# Altium project RogoIR.PrjPcb
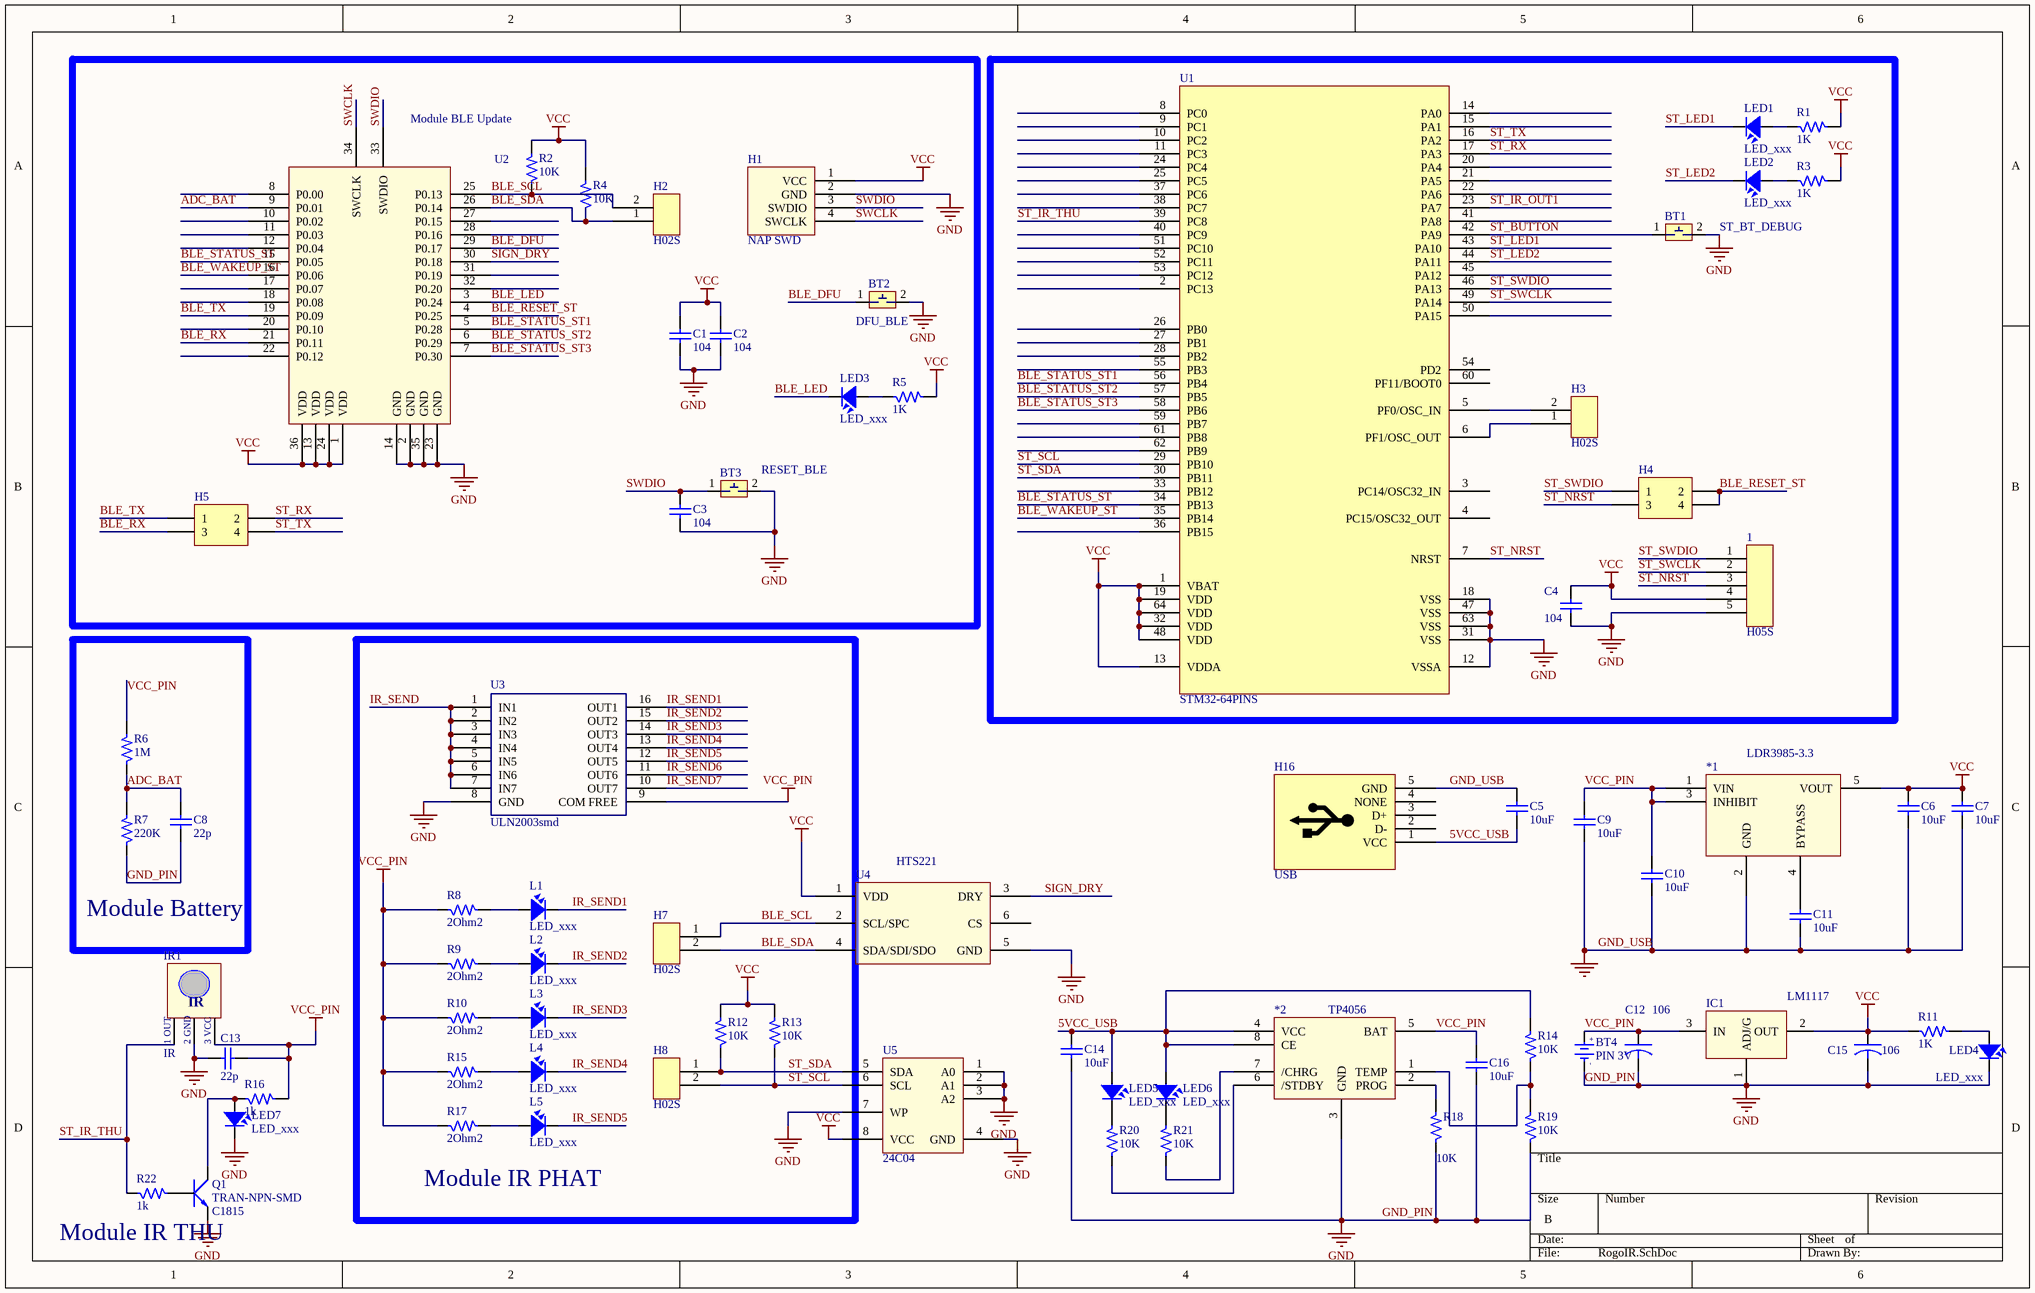
[diagram p0: RogoIR.SchDoc]
1 sheet, 73 parts. Net scope: global (net labels, ports and power ports of the same name join across sheets).
Board file: RogoIR.PcbDoc

## Sheet RogoIR.SchDoc
size B

### Parts
1  H05S  [H05SA]
*1  LDR3985-3.3  [LDR3985-3.3]
*2  TP4056  [TP4056]
BT1  ST_BT_DEBUG  [SW2-SMD]
BT2  DFU_BLE  [SW2-SMD]
BT3  RESET_BLE  [SW2-SMD]
BT4  PIN 3V  [H02MA]
C1  104  [0805]
C2  104  [0805]
C3  104  [0805]
C4  104  [0805]
C5  10uF  [0805]
C6  10uF  [0805]
C7  10uF  [0805]
C8  22p  [0805]
C9  10uF  [0805]
C10  10uF  [0805]
C11  10uF  [0805]
C12  106  [1206]
C13  22p  [0805]
C14  10uF  [0805]
C15  106  [1206]
C16  10uF  [0805]
H1  NAP SWD  [H04SA]
H2  H02S  [H02SA]
H3  H02S  [H02SA]
H4  H04M  [HDR2X2]  (value not drawn)
H5  H04M  [HDR2X2]  (value not drawn)
H7  H02S  [H02SA]
H8  H02S  [H02SA]
H16  USB  [Micro_USB]
IC1  LM1117  [lm1117-3.3]
IR1  IR  [H03SA]
L1  value LED_xxx  [LED_Z5]  (hidden comment: LED_Z5)
L2  value LED_xxx  [LED_Z5]  (hidden comment: LED_Z5)
L3  value LED_xxx  [LED_Z5]  (hidden comment: LED_Z5)
L4  value LED_xxx  [LED_Z5]  (hidden comment: LED_Z5)
L5  value LED_xxx  [LED_Z5]  (hidden comment: LED_Z5)
LED1  value LED_xxx  [0805]  (hidden comment: LED)
LED2  value LED_xxx  [0805]  (hidden comment: LED)
LED3  value LED_xxx  [0805]  (hidden comment: LED)
LED4  value LED_xxx  [0805]  (hidden comment: LED)
LED5  value LED_xxx  [0805]  (hidden comment: LED)
LED6  value LED_xxx  [0805]  (hidden comment: LED)
LED7  value LED_xxx  [0805]  (hidden comment: LED)
Q1  TRAN-NPN-SMD  value C1815  [TRAN-NPN-SMD]
R1  1K  [0805]
R2  value 10K  [0805]  (hidden comment: RESISTOR)
R3  1K  [0805]
R4  value 10K  [0805]  (hidden comment: RESISTOR)
R5  1K  [0805]
R6  1M  [0805]
R7  220K  [0805]
R8  2Ohm2  [0805]
R9  2Ohm2  [0805]
R10  2Ohm2  [0805]
R11  1K  [0805]
R12  value 10K  [0805]  (hidden comment: RESISTOR)
R13  value 10K  [0805]  (hidden comment: RESISTOR)
R14  value 10K  [0805]  (hidden comment: RESISTOR)
R15  2Ohm2  [0805]
R16  1k  [0805]
R17  2Ohm2  [0805]
R18  value 10K  [0805]  (hidden comment: RESISTOR)
R19  value 10K  [0805]  (hidden comment: RESISTOR)
R20  value 10K  [0805]  (hidden comment: RESISTOR)
R21  value 10K  [0805]  (hidden comment: RESISTOR)
R22  1k  [0805]
U1  STM32-64PINS  [LQFP64Pins]
U2  Module BLE Update  [Module Ble]
U3  ULN2003smd  [ULN2003-smd16P]
U4  HTS221  [HTS221]
U5  24C04  [24C04SOIC]

### Blocks framed on the sheet
Module Battery: C8 R6 R7
Module IR PHAT: H7 H8 L1-L5 R8-R10 R12 R13 R15 R17 U3

### Nets
GND_PIN: 1.5 *1.2(GND) *2.3(GND) BT1.2 BT2.2 BT3.2 BT4.2(GND) C1.2 C2.2 C3.2 C4.2 C5.1 C6.2 C7.2 C8.1 C9.2 C10.2 C11.2 C12.2 C13.2 C14.2 C15.2 C16.2 H1.2(GND) H16.5(GND) IC1.1(ADJ/G) IR1.2(GND) LED4.2 LED7.2 Q1.2(E) R7.1 R18.1 R19.1 U1.12(VSSA) U1.18(VSS) U1.31(VSS) U1.47(VSS) U1.63(VSS) U2.2(GND) U2.14(GND) U2.23(GND) U2.35(GND) U3.8(GND) U4.5(GND) U5.1(A0) U5.2(A1) U5.3(A2) U5.4(GND) U5.7(WP)  [also labelled GND, GND_USB]
VCC: 1.4 *1.5(VOUT) C1.1 C2.1 C4.1 C6.1 C7.1 C15.1 H1.1(VCC) IC1.2(OUT) R1.2 R2.2 R3.2 R4.2 R5.2 R11.1 R12.2 R13.2 U1.1(VBAT) U1.13(VDDA) U1.19(VDD) U1.32(VDD) U1.48(VDD) U1.64(VDD) U2.1(VDD) U2.13(VDD) U2.24(VDD) U2.36(VDD) U4.1(VDD) U5.8(VCC)
VCC_PIN: *1.1(VIN) *1.3(INHIBIT) *2.5(BAT) BT4.1(+3V) C9.1 C10.1 C12.1 C13.1 C16.1 IC1.3(IN) IR1.3(VCC) R6.2 R8.1 R9.1 R10.1 R15.1 R16.2 R17.1 U3.9(COM_FREE)
5VCC_USB: *2.4(VCC) *2.8(CE) C5.2 C14.1 H16.1(VCC) LED5.1 LED6.1 R14.2
ADC_BAT: C8.2 R6.1 R7.2 U2.9(P0.01)
BLE_DFU: BT2.1 U2.29(P0.17)
BLE_LED: LED3.2 U2.3(P0.24)
BLE_RESET_ST: H4.2 H4.4 U2.4(P0.25)
BLE_RX: H5.3 U2.21(P0.11)
BLE_SCL: H2.2 H7.1 R2.1 U2.25(P0.13) U4.2(SCL/SPC)
BLE_SDA: H2.1 H7.2 R4.1 U2.26(P0.14) U4.4(SDA/SDI/SDO)
BLE_STATUS_ST: U1.34(PB13) U2.15(P0.05)
BLE_STATUS_ST1: U1.56(PB4) U2.5(P0.28)
BLE_STATUS_ST2: U1.57(PB5) U2.6(P0.29)
BLE_STATUS_ST3: U1.58(PB6) U2.7(P0.30)
BLE_TX: H5.1 U2.19(P0.09)
BLE_WAKEUP_ST: U1.35(PB14) U2.16(P0.06)
IR_SEND: U3.1(IN1) U3.2(IN2) U3.3(IN3) U3.4(IN4) U3.5(IN5) U3.6(IN6) U3.7(IN7)
IR_SEND1: L1.2 U3.16(OUT1)
IR_SEND2: L2.2 U3.15(OUT2)
IR_SEND3: L3.2 U3.14(OUT3)
IR_SEND4: L4.2 U3.13(OUT4)
IR_SEND5: L5.2 U3.12(OUT5)
IR_SEND6: U3.11(OUT6)
IR_SEND7: U3.10(OUT7)
SIGN_DRY: U2.30(P0.18) U4.3(DRY)
ST_BUTTON: BT1.1 U1.42(PA9)
ST_IR_OUT1: U1.23(PA7)
ST_IR_THU: IR1.1(Out) R22.1 U1.39(PC8)
ST_LED1: LED1.2 U1.43(PA10)
ST_LED2: LED2.2 U1.44(PA11)
ST_NRST: 1.3 H4.3 U1.7(NRST)
ST_RX: H5.2 U1.17(PA3)
ST_SCL: H8.2 R13.1 U1.29(PB10) U5.6(SCL)
ST_SDA: H8.1 R12.1 U1.30(PB11) U5.5(SDA)
ST_SWCLK: 1.2 U1.49(PA14)
ST_SWDIO: 1.1 H4.1 U1.46(PA13)
ST_TX: H5.4 U1.16(PA2)
SWCLK: H1.4(SWCLK) U2.34(SWCLK)
SWDIO: BT3.1 C3.1 H1.3(SWDIO) U2.33(SWDIO)
Net*1_4: *1.4(BYPASS) C11.1
Net*2_1: *2.1(TEMP) R14.1 R19.2
Net*2_2: *2.2(PROG) R18.2
Net*2_6: *2.6(/STDBY) R20.1
Net*2_7: *2.7(/CHRG) R21.1
NetH3_1: H3.1 U1.6(PF1/OSC_OUT)
NetH3_2: H3.2 U1.5(PF0/OSC_IN)
NetL1_1: L1.1 R8.2
NetL2_1: L2.1 R9.2
NetL3_1: L3.1 R10.2
NetL4_1: L4.1 R15.2
NetL5_1: L5.1 R17.2
NetLED1_1: LED1.1 R1.1
NetLED2_1: LED2.1 R3.1
NetLED3_1: LED3.1 R5.1
NetLED4_1: LED4.1 R11.2
NetLED5_2: LED5.2 R20.2
NetLED6_2: LED6.2 R21.2
NetLED7_1: LED7.1 Q1.3(C) R16.1
NetQ1_1: Q1.1(B) R22.2

Not connected (* = marked no-connect by the designer): H16 0(6) 2(D-) 3(D+) 4(NONE); U1 2(PC13) 3(PC14/OSC32_IN) 4(PC15/OSC32_OUT) 8(PC0) 9(PC1) 10(PC2) 11(PC3) 14(PA0) 15(PA1) 20(PA4) 21(PA5) 22(PA6) 24(PC4) 25(PC5) 26(PB0) 27(PB1) 28(PB2) 33(PB12) 36(PB15) 37(PC6) 38(PC7) 40(PC9) 41(PA8) 45(PA12) 50(PA15) 51(PC10) 52(PC11) 53(PC12) 54(PD2) 55(PB3) 59(PB7) 60(PF11/BOOT0) 61(PB8) 62(PB9); U2 8(P0.00) 10(P0.02) 11(P0.03) 12(P0.04) 17(P0.07) 18(P0.08) 20(P0.10) 22(P0.12) 27(P0.15) 28(P0.16) 31(P0.19) 32(P0.20); U4 6(CS)

### Notes on the sheet
- (near Q1) Module IR THU
- (in symbol IR) 1 OUT; 2 GND; 3 VCC
- (in symbol PIN 3V) +; -

### Library data of the parts
1 = H05S: HEADER, SINGLE
BT1-BT3 = BUTTON 2 PIN
BT4 = PIN 3V: Battery 3VDC; Value: PIN 3V
C1-C11 C13 C14 C16 = Cap
C12 C15 = CAPACITOR
H2 H3 H7 H8 = H02S: HEADER, SINGLE
H4 H5 = H04M: HEADER, DOUBLE; LatestRevisionDate: 17-Jul-2002; LatestRevisionNote: Re-released for DXP Platform.; Publisher: Altium Limited
H16 = USB: USB conector
IC1 = LM1117: Available in 1.8V, 2.5V, 2.85V, 3.3V, 5V, and  Adjustable Versions; Value: LM317
IR1 = IR: Receiver Infraed IC
L1-L5 = LED_Z5: LED Single colour Green and Red
LED1-LED7 = LED: LED Single colour Green and Red
Q1 = TRAN-NPN-SMD: NPN 600mW, ECB
R1 R3 R5-R11 R15-R17 R22 = Res: Resistor 1/4W; Value: R1/4W - 1K
R2 R4 R12-R14 R18-R21 = RESISTOR: Resistor 1/4W